# EAGLE design hub1 (EAGLE 4.16)
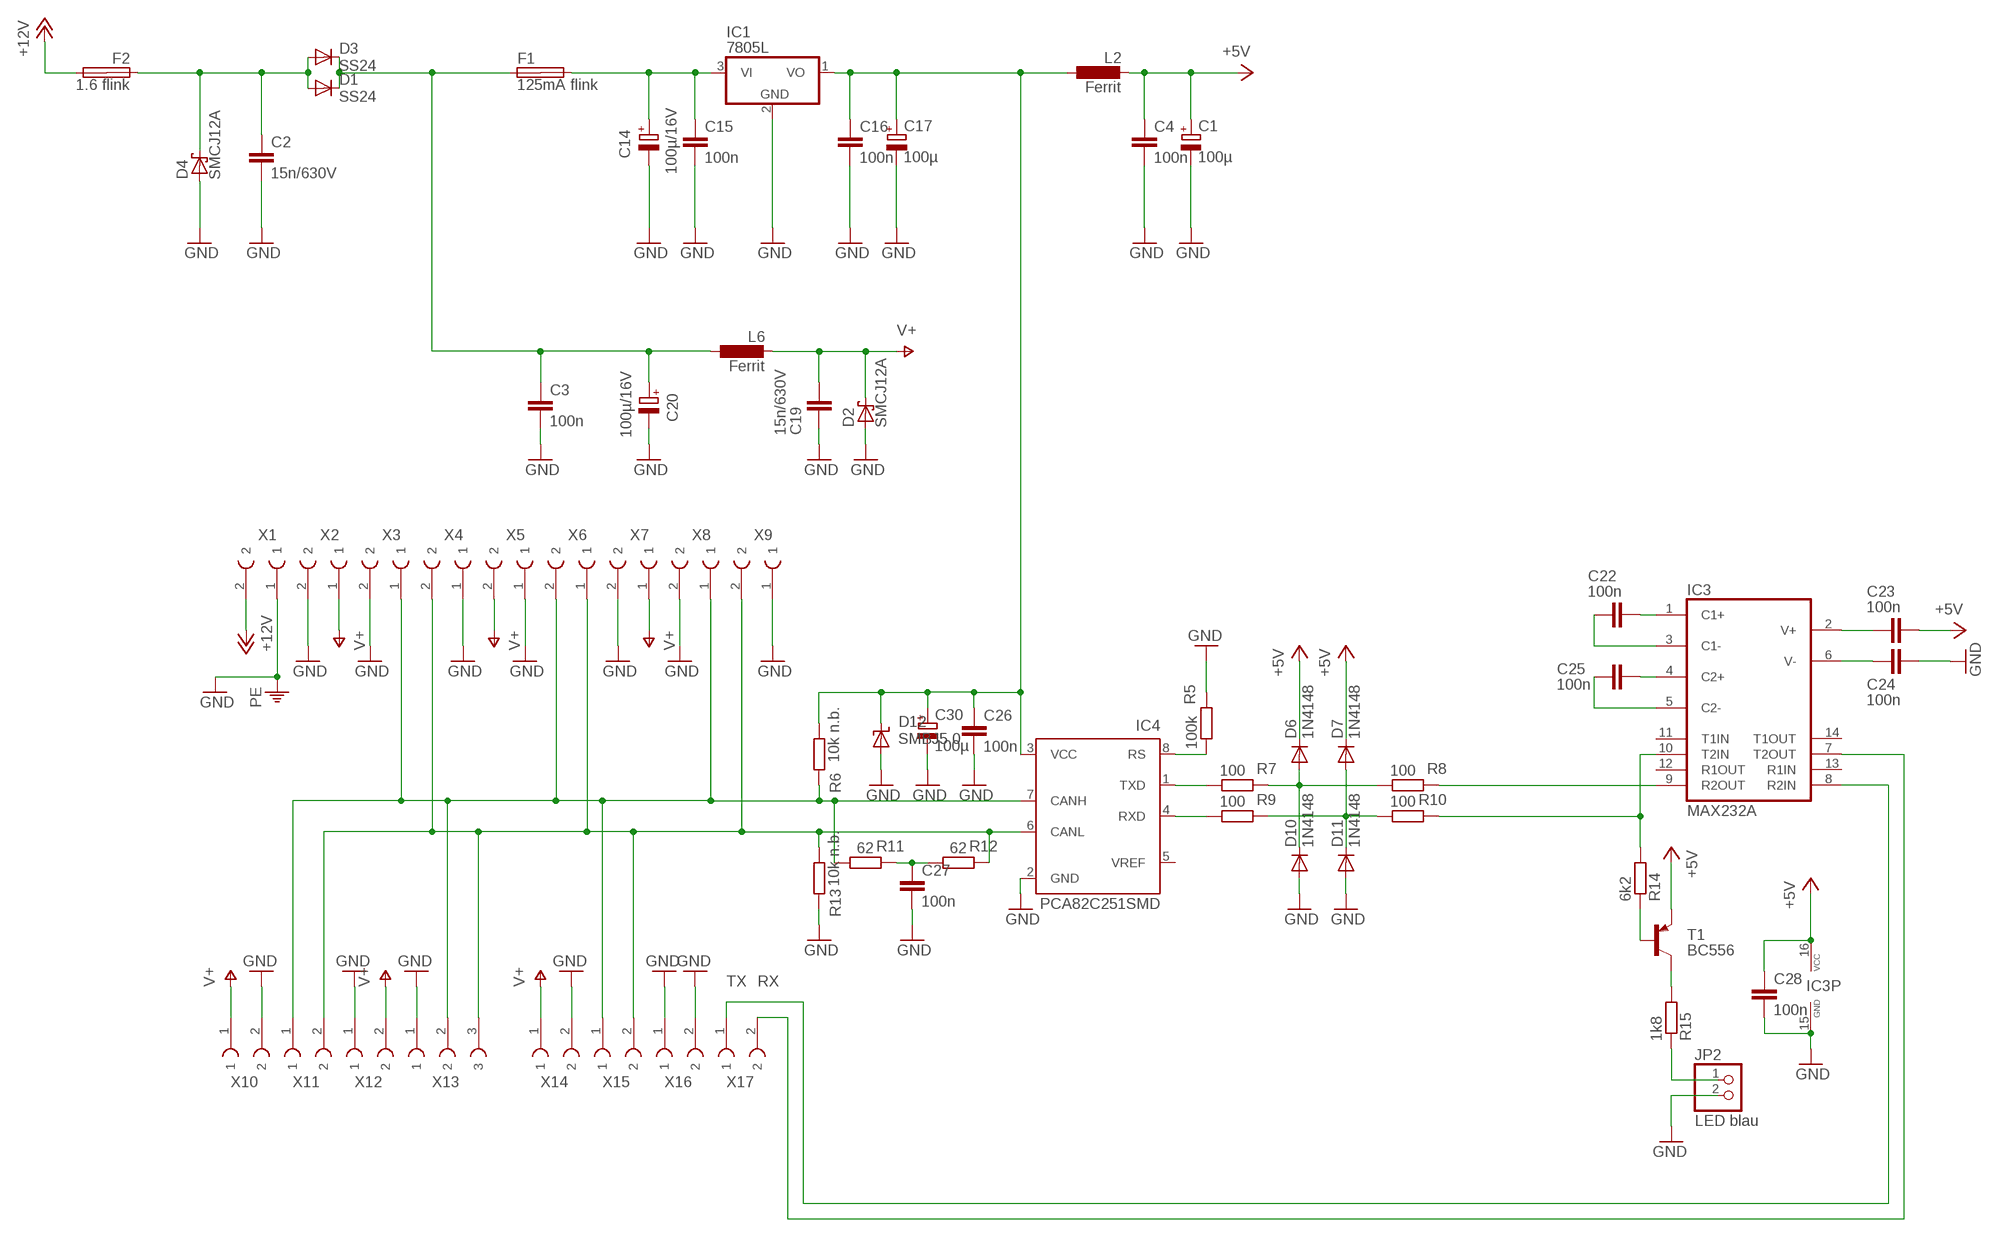
[diagram p0: schematic, sheet 1]

## Parts
C1  100µ  CPOL-EUE5-6  [E5-6]
C2  15n/630V  C-EU075-042X103  [C075-042X103]
C3  100n  C-EU050-024X044  [C050-024X044]
C4  100n  C-EU050-024X044  [C050-024X044]
C14  100µ/16V  CPOL-EUE5-6  [E5-6]
C15  100n  C-EU050-024X044  [C050-024X044]
C16  100n  C-EU050-024X044  [C050-024X044]
C17  100µ  CPOL-EUE5-6  [E5-6]
C19  15n/630V  C-EU075-042X103  [C075-042X103]
C20  100µ/16V  CPOL-EUE5-6  [E5-6]
C22  100n  C-EU050-024X044  [C050-024X044]
C23  100n  C-EU050-024X044  [C050-024X044]
C24  100n  C-EU050-024X044  [C050-024X044]
C25  100n  C-EU050-024X044  [C050-024X044]
C26  100n  C-EU050-024X044  [C050-024X044]
C27  100n  C-EU050-024X044  [C050-024X044]
C28  100n  C-EU050-024X044  [C050-024X044]
C30  100µ  CPOL-EUE5-6  [E5-6]
D1  SS24  DIODE-SMB  [SMB]
D2  SMCJ12A  SCHOTTKY-DIODESMC  [SMC]
D3  SS24  DIODE-SMB  [SMB]
D4  SMCJ12A  SCHOTTKY-DIODESMC  [SMC]
D6  1N4148  DIODE-D-2.5  [D-2.5]
D7  1N4148  DIODE-D-2.5  [D-2.5]
D10  1N4148  DIODE-D-2.5  [D-2.5]
D11  1N4148  DIODE-D-2.5  [D-2.5]
D12  SMBJ5.0  SUPPRESSOR-SMBJ  [SMBJ]
F1  125mA flink  SHK20L  [SHK20L]
F2  1.6 flink  SHK20L  [SHK20L]
IC1  7805L  [TO92]
IC3  MAX232A  MAX232  [DIL16]
IC4  PCA82C251SMD  PCA82C250SMD  [SO8]
JP2  LED blau  PINHD-1X2  [1X02]
L2  Ferrit  L-EUL1806  [L1806]
L6  Ferrit  L-EUL1806  [L1806]
R5  100k  R-EU_0207/2V  [0207/2V]
R6  10k n.b.  R-EU_0207/2V  [0207/2V]
R7  100  R-EU_0207/2V  [0207/2V]
R8  100  R-EU_0207/2V  [0207/2V]
R9  100  R-EU_0207/2V  [0207/2V]
R10  100  R-EU_0207/2V  [0207/2V]
R11  62  R-EU_0207/2V  [0207/2V]
R12  62  R-EU_0207/2V  [0207/2V]
R13  10k n.b.  R-EU_0207/2V  [0207/2V]
R14  6k2  R-EU_0207/2V  [0207/2V]
R15  1k8  R-EU_0207/2V  [0207/2V]
T1  BC556  -PNP-TO92  [TO92]
X1  AR-KLEMME_508_2POLPTR  [W237-2E]
X2  AR-KLEMME_508_2POLPTR  [W237-2E]
X3  AR-KLEMME_508_2POLPTR  [W237-2E]
X4  AR-KLEMME_508_2POLPTR  [W237-2E]
X5  AR-KLEMME_508_2POLPTR  [W237-2E]
X6  AR-KLEMME_508_2POLPTR  [W237-2E]
X7  AR-KLEMME_508_2POLPTR  [W237-2E]
X8  AR-KLEMME_508_2POLPTR  [W237-2E]
X9  AR-KLEMME_508_2POLPTR  [W237-2E]
X10  AR-KLEMME_508_2POLPTR  [W237-2E]
X11  AR-KLEMME_508_2POLPTR  [W237-2E]
X12  AR-KLEMME_508_2POLPTR  [W237-2E]
X13  AR-KLEMME_508_3POLPTR  [W237-3E]
X14  AR-KLEMME_508_2POLPTR  [W237-2E]
X15  AR-KLEMME_508_2POLPTR  [W237-2E]
X16  AR-KLEMME_508_2POLPTR  [W237-2E]
X17  AR-KLEMME_508_2POLPTR  [W237-2E]

## Nets
+5V: C1.+ C4.1 C23.2 C28.1 D6.C D7.C IC3.16(VCC) L2.2 T1.1(E)
+12V: F2.2A X1.2
BIN: IC3.10(T2IN) R10.1 R14.2
BUS+: IC4.7(CANH) R6.1 R11.2 X3.1 X6.2 X8.1 X11.1 X13.2 X15.1
BUS-: IC4.6(CANL) R12.1 R13.2 X4.2 X6.1 X9.2 X11.2 X13.3 X15.2
GND: C1.- C2.2 C3.2 C4.2 C14.- C15.2 C16.2 C17.- C19.2 C20.- C24.2 C26.2 C27.2 C28.2 C30.- D2.A D4.A D10.A D11.A D12.A IC1.2(GND) IC3.15(GND) IC4.2(GND) JP2.2 R5.1 R13.1 X1.1 X2.2 X3.2 X4.1 X5.1 X7.2 X8.2 X9.1 X10.2 X12.1 X13.1 X14.2 X16.1 X16.2 ; supply symbol labelled PE
N$1: C23.1 IC3.2(V+)
N$2: C27.1 R11.1 R12.2
N$3: C24.1 IC3.6(V-)
N$4: IC4.8(RS) R5.2
N$5: C14.+ C15.1 F1.2A IC1.3(VI)
N$6: C22.1 IC3.1(C1+)
N$7: C22.2 IC3.3(C1-)
N$8: C25.1 IC3.4(C2+)
N$9: C25.2 IC3.5(C2-)
N$10: C16.1 C17.+ C26.1 C30.+ D12.C IC1.1(VO) IC4.3(VCC) L2.1 R6.2
N$11: IC3.9(R2OUT) R8.1
N$12: C3.1 C20.+ D1.C D3.C F1.1A L6.1
N$13: C2.1 D1.A D3.A D4.C F2.1A
N$15: IC4.1(TXD) R7.2
N$16: IC4.4(RXD) R9.2
N$18: R14.1 T1.2(B)
N$19: R15.2 T1.3(C)
N$20: JP2.1 R15.1
N$21: D6.A D10.C R7.1 R8.2
N$27: D7.A D11.C R9.1 R10.2
RX: IC3.7(T2OUT) X17.2
TX: IC3.8(R2IN) X17.1
V+: C19.1 D2.C L6.2 X2.1 X5.2 X7.1 X10.1 X12.2 X14.1
Unconnected: F1.1B F1.2B F2.1B F2.2B IC3.11(T1IN) IC3.12(R1OUT) IC3.13(R1IN) IC3.14(T1OUT) IC4.5(VREF)

## Library data of the parts
C1 C14 C17 C20 C30 = rcl:CPOL-EU: POLARIZED CAPACITOR, European symbol
C2-C4 C15 C16 C19 C22-C28 = rcl:C-EU: CAPACITOR, European symbol
D1 D3 D6 D7 D10 D11 = diode:DIODE-: DIODE
D2 D4 = diode:SCHOTTKY-DIODE: Schottky Diode
D12 = diode:SUPPRESSOR-: Suppressor diode
F1 F2 = fuse:SHK20L: FUSE HOLDER 5 x 20 mm, SH contact, SHH1 Schukat, E1073 Buerklin
IC1 = linear:78*: Positive VOLTAGE REGULATOR Source: http://cache.national.com/ds/LM/LM78L05.pdf http://www.fairchildsemi.com/ds/LM/LM7805.pdf
IC3 = maxim:MAX232: RS232 TRANSEIVER
IC4 = mylib:PCA82C250: CAN CONTROLLER INTERFACE
JP2 = pinhead:PINHD-1X2: PIN HEADER
L2 L6 = mylib:L-EU: INDUCTOR, European symbol
R5-R15 = rcl:R-EU_: RESISTOR, European symbol
T1 = transistor:*-PNP-: PNP Transistror
X1-X12 X14-X17 = mylib:AR-KLEMME_508_2POL
X13 = mylib:AR-KLEMME_508_3POL

## Board
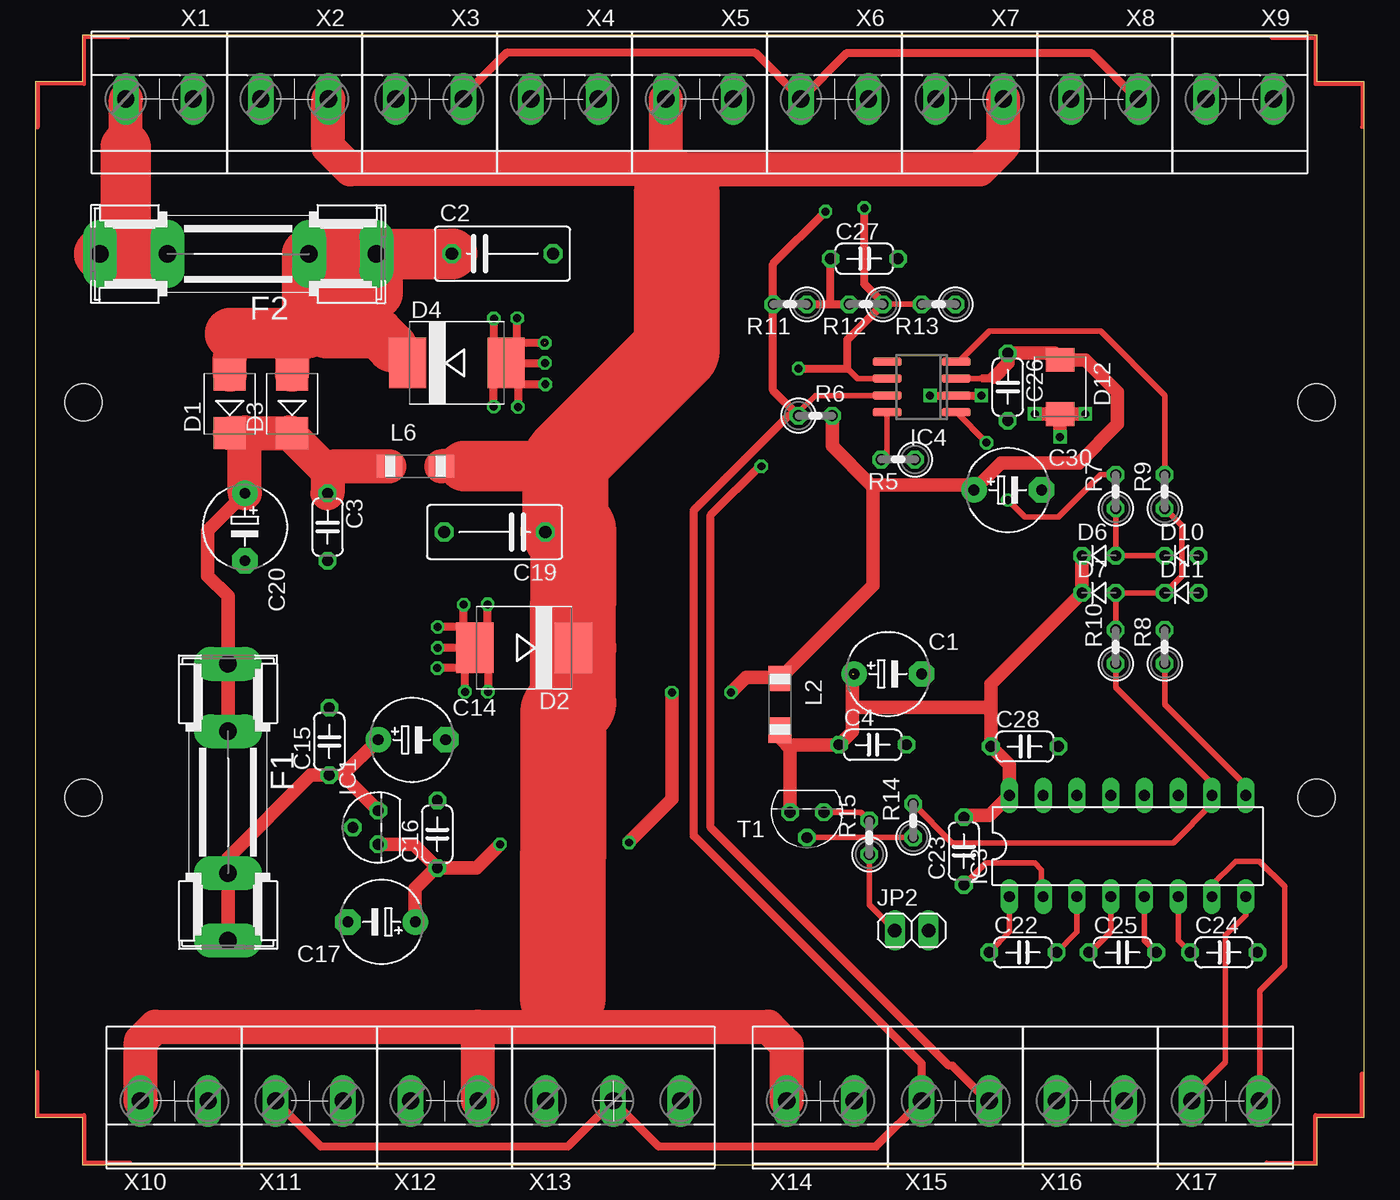
[diagram p1: board, top side]
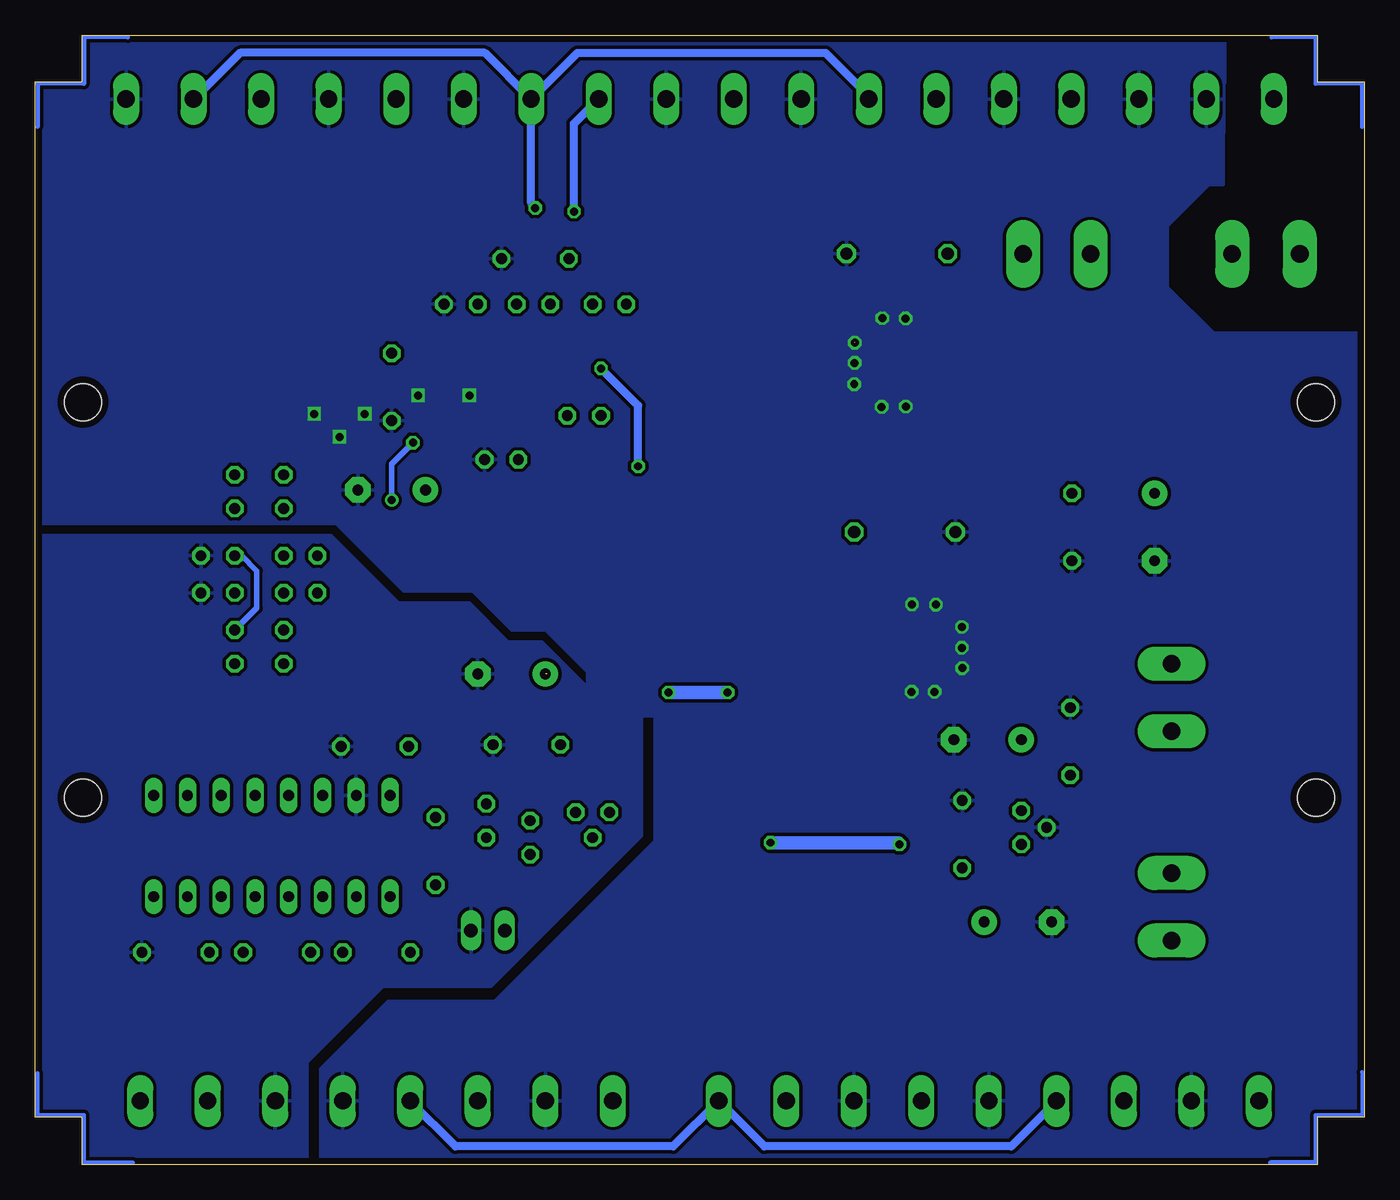
[diagram p2: board, bottom side, seen from below]

Size 100 x 84.99 mm. Coordinates in mm from the lower left corner, seen from the top.
Copper layers (1*16): Top 0.035mm / dielectric 1.5mm / Bottom 0.035mm
Design rules "Bilex DRU": minimum track width 10mil, minimum drill 24mil, track to track 10mil, track to pad 10mil, pad to pad 10mil, via to via 10mil, smd to smd 10mil, copper to edge 20mil, drill to drill 8mil, minimum pad ring 10mil, minimum via ring 8mil, stop-mask expansion 4mil, vias tented up to drill 24mil, thermal gap 10mil

### Footprints (pad centres in the part's own frame; a part is rotated, then mirrored left to right if it is on the bottom)
E5-6 = drill 0.813 pad 1.905 round: + -2.54,0 | drill 0.813 pad 1.905 octagon: - 2.54,0
C075-042X103 = drill 0.914 octagon: 1 -3.81,0; 2 3.81,0
C050-024X044 = drill 0.813 octagon: 1 -2.54,0; 2 2.54,0
SMB = smd 2.4 x 2.4: A 2.2,0; C -2.2,0
SMC = smd 2.8 x 3.8: A 3.7,0; C -3.7,0
D-2.5 = drill 0.813 octagon: A 1.27,0; C -1.27,0
SMBJ = smd 1.78 x 2.16: A 2.04,0; C -2.03,0
SHK20L = drill 1.321 pad 2.54 long: 1A -10.414,0; 1B -5.334,0; 2A 10.414,0; 2B 5.334,0
TO92 = drill 0.813 octagon: 1 -1.27,0; 2 0,1.905; 3 1.27,0
DIL16 = drill 0.813 long: 1 -8.89,-3.81; 2 -6.35,-3.81; 3 -3.81,-3.81; 4 -1.27,-3.81; 5 1.27,-3.81; 6 3.81,-3.81; 7 6.35,-3.81; 8 8.89,-3.81; 9 8.89,3.81; 10 6.35,3.81; 11 3.81,3.81; 12 1.27,3.81; 13 -1.27,3.81; 14 -3.81,3.81; 15 -6.35,3.81; 16 -8.89,3.81
SO8 = smd 0.6 x 2.2: 1 -1.905,-2.6; 2 -0.635,-2.6; 3 0.635,-2.6; 4 1.905,-2.6; 5 1.905,2.6; 6 0.635,2.6; 7 -0.635,2.6; 8 -1.905,2.6
1X02 = drill 1.016 long: 1 -1.27,0; 2 1.27,0
L1806 = smd 1.9 x 1.7: 1 -0.68,0; 2 3.22,0
0207/2V = drill 0.813 octagon: 1 -1.27,0; 2 1.27,0
TO92' = drill 0.813 octagon: 1 1.27,0; 2 0,1.905; 3 -1.27,0
GEHÄUSE_MR6 = hole 2.8: 3.632,57.379; 3.632,27.61; 96.418,27.61; 96.418,57.379
W237-2E = drill 1.3 long: 1 -2.54,0; 2 2.54,0
W237-3E = drill 1.3 long: 1 -5.08,0; 2 0,0; 3 5.08,0

### Placement (x,y rotation side)
C1  64.16,36.93 0 top
C2  35.15,68.55 0 top
C3  22,47.98 270 top
C4  63.02,31.6 0 top
C14  28.35,31.98 0 top
C15  22.12,31.85 90 top
C16  30.25,24.87 90 top
C17  26.06,18.26 180 top
C19  34.57,47.6 180 top
C20  15.77,47.98 270 top
C22  74.32,15.98 0 top
C23  69.88,23.6 90 top
C24  89.43,15.98 0 top
C25  81.81,15.98 0 top
C26  73.18,58.52 270 top
C27  62.38,68.17 0 top
C28  74.45,31.47 0 top
C30  73.18,50.77 0 top
D1  14.63,57.25 90 top
D2  36.78,38.89 180 top
D3  19.33,57.25 90 top
D4  31.72,60.32 0 top
D6  80.04,45.82 0 top
D7  80.04,43.03 0 top
D10  86.26,45.82 0 top
D11  86.26,43.03 0 top
D12  77.11,58.52 270 top
F1  14.5,27.28 270 top
F2  15.27,68.53 180 top
IC1  25.81,25.37 90 top
IC3  82.19,23.98 0 top
IC4  66.7,58.52 90 top
JP2  65.94,17.63 0 top
L2  56.03,35.92 270 top
L6  27.33,52.55 0 top
R5  64.92,53.06 180 top
R6  58.7,56.36 0 top
R7  81.31,50.65 90 top
R8  84.99,38.96 90 top
R9  84.99,50.65 90 top
R10  81.31,38.96 90 top
R11  56.79,64.74 180 top
R12  62.51,64.74 180 top
R13  67.97,64.74 180 top
R14  66.07,25.88 90 top
R15  62.76,24.61 90 top
T1  BC556  [TO92']  58.06,26.52 180 top
U$1  [GEHÄUSE_MR6]  0,0 0 top
X1  9.35,80.19 180 top
X2  19.51,80.19 180 top
X3  29.67,80.19 180 top
X4  39.83,80.19 180 top
X5  49.99,80.19 180 top
X6  60.15,80.19 180 top
X7  70.31,80.19 180 top
X8  80.47,80.19 180 top
X9  90.63,80.19 180 top
X10  10.46,4.8 0 top
X11  20.62,4.8 0 top
X12  30.78,4.8 0 top
X13  43.48,4.8 0 top
X14  59.08,4.8 0 top
X15  69.24,4.8 0 top
X16  79.4,4.8 0 top
X17  89.56,4.8 0 top

### Tracks (layer width: path | path; a pad name or v marks a point on that pad's centre or on a via)
+5V  (1 unrouted)
  Top 1.016: D6.C D7.C 71.91,36.17 71.91,34.39 | 71.91,34.39 C28.1 73.3,30.07 IC3.16 71.78,26.26 69.88,26.26 C23.2 | 61.49,34.39 61.49,32.61 C4.1 57.13,31.6 56.84,31.3 | 61.49,34.39 61.49,36.93 | 61.49,34.39 71.91,34.39 | 56.84,31.3 56.79,31.26 T1.1 | L2.2 56.03,32.11 56.84,31.3
+12V
  Top 2.54: 6.81,76.58 X1.2
  Top 3.81: F2.2A 4.83,68.53 4.8,68.55 6.88,68.55 | 6.88,68.55 8.99,68.55 | 6.88,68.55 6.88,68.58 6.81,68.58 6.81,76.58
BIN
  Top 0.406: R10.1 81.31,35.92 88.54,28.68 IC3.10 | IC3.10 88.54,27.66 | IC3.10 88.54,27.15 85.62,24.23 68.99,24.23 R14.2
BUS+  (via drill 0.6)
  Top 0.406: 64.16,57.89 IC4.7 58.7,57.89 57.43,56.62 R6.1
  Top 0.61: v59.46,71.73 55.52,67.79 R11.2 55.52,58.27 R6.1 56.67,56.36 53.49,53.19 | 53.49,53.19 53.37,53.06 | 53.49,53.19 49.56,49.25 49.56,24.74 66.7,7.59 X15.1 | 32.21,80.14 X3.1 32.21,80.42 35.46,83.67 54.18,83.67 57.66,80.19 X6.2 61.09,83.67 79.45,83.67 82.98,80.14 83.01,80.16 X8.1 | X11.1 18.08,4.78 21.49,1.37 40.08,1.37 43.48,4.78 X13.2 46.91,1.37 63.27,1.37 X15.1 | X15.1 66.7,4.78
  Bottom 0.61: v59.46,71.73 59.46,78.33 X6.2
BUS-  (via drill 0.6)
  Top 0.406: R12.1 R13.2 | 61.11,59.92 61.87,59.16 IC4.6
  Top 0.61: v62.38,71.98 62.38,66.27 63.91,64.74 R12.1 61.11,62.08 61.11,59.92 v57.43,59.92 | v54.64,52.55 54.64,52.68 50.83,48.87 50.83,25.37 68.76,7.44 69.01,7.44 71.63,4.83 71.78,4.83 X15.2
  Bottom 0.61: v57.43,59.92 54.64,57.12 v54.64,52.55 | 37.29,80.14 X4.2 37.29,80.42 40.54,83.67 59.21,83.67 X6.1 | X6.1 62.64,80.14 | X6.1 66.17,83.67 84.58,83.67 88.09,80.16 | v62.38,71.98 62.31,71.98 62.69,72.36 X6.1 | 88.09,80.16 88.11,80.14 | 88.09,80.16 X9.2 | X11.2 23.19,4.8 23.19,4.75 26.57,1.37 45.14,1.37 X13.3 51.99,1.37 68.38,1.37 71.78,4.78 X15.2
GND  (via drill 0.6)  (1 unrouted)
  Top 0.406: D12.A 76.61,55.98
  Top 0.61: v67.34,57.89 IC4.2 v71.2,57.89 | 38.38,60.32 v38.35,60.32 | 35.46,60.32 36.32,60.32 | 36.32,60.32 38.38,60.32 | 38.38,60.32 38.38,60.3 | 36.17,61.87 38.35,61.87 | 36.27,63.75 36.25,63.75 36.25,61.11 35.43,60.3 | 34.54,63.7 34.52,63.7 34.52,61.21 35.41,60.32 D4.A | 35.46,60.32 D4.A | v34.49,57.05 34.49,59.36 35.43,60.3 | 35.43,60.3 35.46,60.32 | 36.32,60.32 36.32,60.4 | 36.32,60.32 36.32,58.72 | 36.32,58.72 v36.32,57.02 | 36.32,58.72 36.3,58.72 | 36.32,58.72 v38.38,58.72 | 35.43,60.3 35.42,60.31 D4.A | D2.A 33.08,38.87 33.05,38.84 34.06,37.82 v34.06,35.59 | D2.A 32.33,38.15 32.33,37.36 | v32.33,35.59 32.33,37.36 | 33.12,38.86 33.1,38.89 D2.A | D2.A 32.99,38.89 32.97,38.86 32.94,38.89 v30.28,38.89 | 33.02,38.89 32.99,38.86 32.23,39.62 32.23,40.46 | 32.23,40.46 v32.23,42.14 | 33.02,38.89 32.99,38.91 34.04,39.95 v34.04,42.16 | D2.A 33.02,38.89 | 32.23,40.46 32.28,40.46 | 32.23,40.46 v30.28,40.46 | 32.33,37.36 v30.25,37.36
  Top 1.016: v77.11,54.76 D12.A | D12.A v75.21,56.49 | D12.A v79.02,56.49
  other vias: 34.52,63.68 36.27,63.7 38.33,61.85
  pour Bottom: 10.57,81.46 10.59,73.74 11.73,73.71 14.81,70.64 14.81,66.04 11.33,62.56 0.18,62.56 0.13,3.71 3.66,3.71 3.66,0.13 78.51,0.13 78.51,7.21 73.43,12.29 65.43,12.29 53.37,24.36 53.37,33.76 54.38,33.76 54.38,24.74 65.68,13.44 73.81,13.44 79.53,7.72 79.53,0.13 96.34,0.13 96.34,3.71 99.87,3.71 99.87,47.35 77.75,47.35 72.67,42.27 67.34,42.27 64.41,39.34 61.87,39.34 58.45,35.92 58.45,37.06 61.62,40.23 64.16,40.23 67.08,43.15 72.29,43.15 77.37,48.23 99.87,48.23 99.85,81.33 96.34,81.33 96.34,84.86 14.43,84.94 14.27,85.09 13.54,84.84 10.62,84.84 10.49,85.14 10.08,84.94 10.49,84.91 10.49,81.41
N$1
  Top 0.406: C23.1 71.53,22.71 75.21,22.71 75.72,22.2 75.72,20.17 IC3.2
N$2
  Top 0.61: R11.1 59.84,64.74 | 59.84,64.74 R12.2 | 59.84,64.74 C27.1
N$3
  Top 0.406: IC3.6 86,16.87 C24.1
N$4
  Top 0.406: IC4.8 64.1,53.51 R5.2
N$5
  Top 0.61: C15.1 23.14,29.31
  Top 1.016: F1.2A 14.5,23.09 20.73,29.31 C15.1 | IC1.3 23.14,29.31 C14.+
N$6
  Top 0.406: 71.65,15.85 C22.1 73.3,17.5 IC3.1
N$7
  Top 0.406: IC3.3 78.38,17.5 C22.2
N$8
  Top 0.406: C25.1 79.27,15.85 80.92,17.5 IC3.4
N$9
  Top 0.406: C25.2 83.46,16.87 IC3.5
N$10  (via drill 0.6)
  Top 0.406: 71.27,59.16 IC4.3 | D12.C 76.61,61.06
  Top 0.61: 72.16,59.28 72.03,59.16 71.27,59.16 | 30.25,22.45 C16.1
  Top 1.016: L2.1 55.95,36.68 | L2.1 63.02,43.58 63.02,51.16 | L2.1 56.03,36.68 53.49,36.68 v52.35,35.53 | D12.C 77.11,60.68 76.73,61.06 C26.1 73.18,60.3 72.16,59.28 | D12.C | D12.C 79.02,60.55 81.43,58.14 81.43,55.73 78.51,52.81 72.67,52.81 C30.+ 70.26,51.16 63.02,51.16 | R6.2 59.97,54.08 62.89,51.16 63.02,51.16 | IC1.1 28.47,24.1 C16.1 33.2,22.33 v34.98,24.1 | C17.+ 28.6,20.8 30.25,22.45 | v44.68,24.23 44.68,24.28 47.9,27.51 v47.9,35.53
  Bottom 1.016: v47.9,35.53 v52.35,35.53 | v34.98,24.1 34.93,24.1 35.05,24.23 v44.68,24.23
N$11
  Top 0.406: R8.1 84.99,34.65 91.08,28.55 IC3.9 91.08,27.66
N$12
  Top 1.016: 14.5,32.61 F1.1A 14.5,42.77 12.98,44.3 12.98,47.73 C20.+
  Top 2.54: 15.77,55.05 D1.C | 15.77,55.05 19.16,55.05 19.2,55.09 19.24,55.05 D3.C 19.12,55.05 | 15.77,55.05 15.77,55.09 | C20.+ 15.77,55.05 | 19.12,55.05 19.08,55.09 | 22,52.04 22,52.17 19.12,55.05 | 22,52.04 C3.1 | L6.1 22.5,52.55 22,52.04
N$13
  Top 0.61: 14.63,60.76 14.66,60.76 14.66,62.48 | 20.4,62.56 20.4,62.48 19.33,61.42 19.33,60.81
  Top 2.54: D1.A 14.63,60.76 14.63,60.81 | 19.33,60.81 D3.A | D4.C 26.85,61.5 26.85,61.52
  Top 3.81: C2.1 31.37,68.55 31.34,68.53 F2.1A | F2.1A 20.47,68.53 20.47,62.56 20.4,62.56 14.66,62.56 14.66,62.48 | 26.85,61.52 25.81,62.56 21.87,62.56 21.87,65.58 25.76,65.58 25.76,68.53 F2.1A
N$15  (via drill 0.6)
  Top 0.406: v71.59,54.33 IC4.1 | v73.18,50.01 74.45,48.74 76.99,48.74 80.16,51.92 R7.2
  Bottom 0.406: v71.59,54.33 73.18,52.74 v73.18,50.01
N$16
  Top 0.406: IC4.4 69.49,60.43 71.78,62.71 80.16,62.71 84.99,57.89 R9.2
N$18
  Top 0.406: T1.2 R14.1
N$19
  Top 0.406: R15.2 62.13,26.52 T1.3
N$20
  Top 0.406: R15.1 62.76,19.53 JP2.1
N$21
  Top 0.406: R7.1 D6.A D10.C
  Bottom 0.406: R8.2 83.34,41.88 83.34,44.68 84.48,45.82 D10.C
N$27
  Top 0.406: R9.1 86.26,48.11 86.26,44.3 D11.C D7.A R10.2
RX
  Top 0.406: IC3.7 88.54,21.06 90.32,22.83 92.1,22.83 94.01,20.93 94.01,14.96 92.13,13.08 92.13,4.8 X17.2
TX
  Top 0.406: IC3.8 91.08,18.77 89.56,17.25 89.56,7.72 87.05,5.21 87.05,4.78 | 87.05,4.78 87.05,4.72 | X17.1 87.05,4.78
V+
  Top 1.016: 39.9,10.52 39.8,10.52 39.7,10.62 39.7,12.62
  Top 1.27: 48.29,73.05 48.29,74.9
  Top 1.676: 39.9,10.64 39.88,10.64 39.88,11.1
  Top 2.184: 48.29,74.9 47.42,74.9
  Top 2.54: 32.28,52.55 L6.2 | 33.3,10.39 9.04,10.39 7.95,9.3 7.95,4.8 X10.1 | 33.3,10.39 39.9,10.39 | 39.9,10.39 55.14,10.39 56.54,8.99 X14.1 | 39.9,10.39 39.9,10.52 39.9,10.64 39.9,11.28 | 40.48,42.41 40.49,42.42 | 40.49,34.77 40.48,34.78 | X12.2 33.3,4.8 33.3,10.39 | X5.2 47.45,74.93 47.42,74.9 23.7,74.9 22.05,76.56 X2.1 | 48.29,74.9 71.07,74.9 72.85,76.68 X7.1
  Top 3.81: 38.38,47.73 C19.1 39.9,47.6 39.9,47.09 39.88,47.09 40.44,47.65 40.44,47.7 40.49,47.65 | 39.9,52.93 39.9,52.55 32.28,52.55 | 39.75,34.04 40.49,34.77 | 39.7,23.29 39.75,23.34
  Top 6.452: 48.29,73.05 48.29,61.32 39.9,52.93 | 39.9,47.6 39.9,52.55 | 40.48,42.41 D2.C 40.48,34.78 | 40.49,42.42 40.49,47.65 | 39.75,23.34 39.75,34.04 | 39.7,12.62 39.7,23.29